# EasyEDA schematic SCH_Esp32-Dev-board_2026-06-18.json
TITLE: Sheet_1; REV: 1.0; Date: 2026-06-16; Sheet: 1/1; Drawn By: vivaanchauhan4569; Company: Your Company
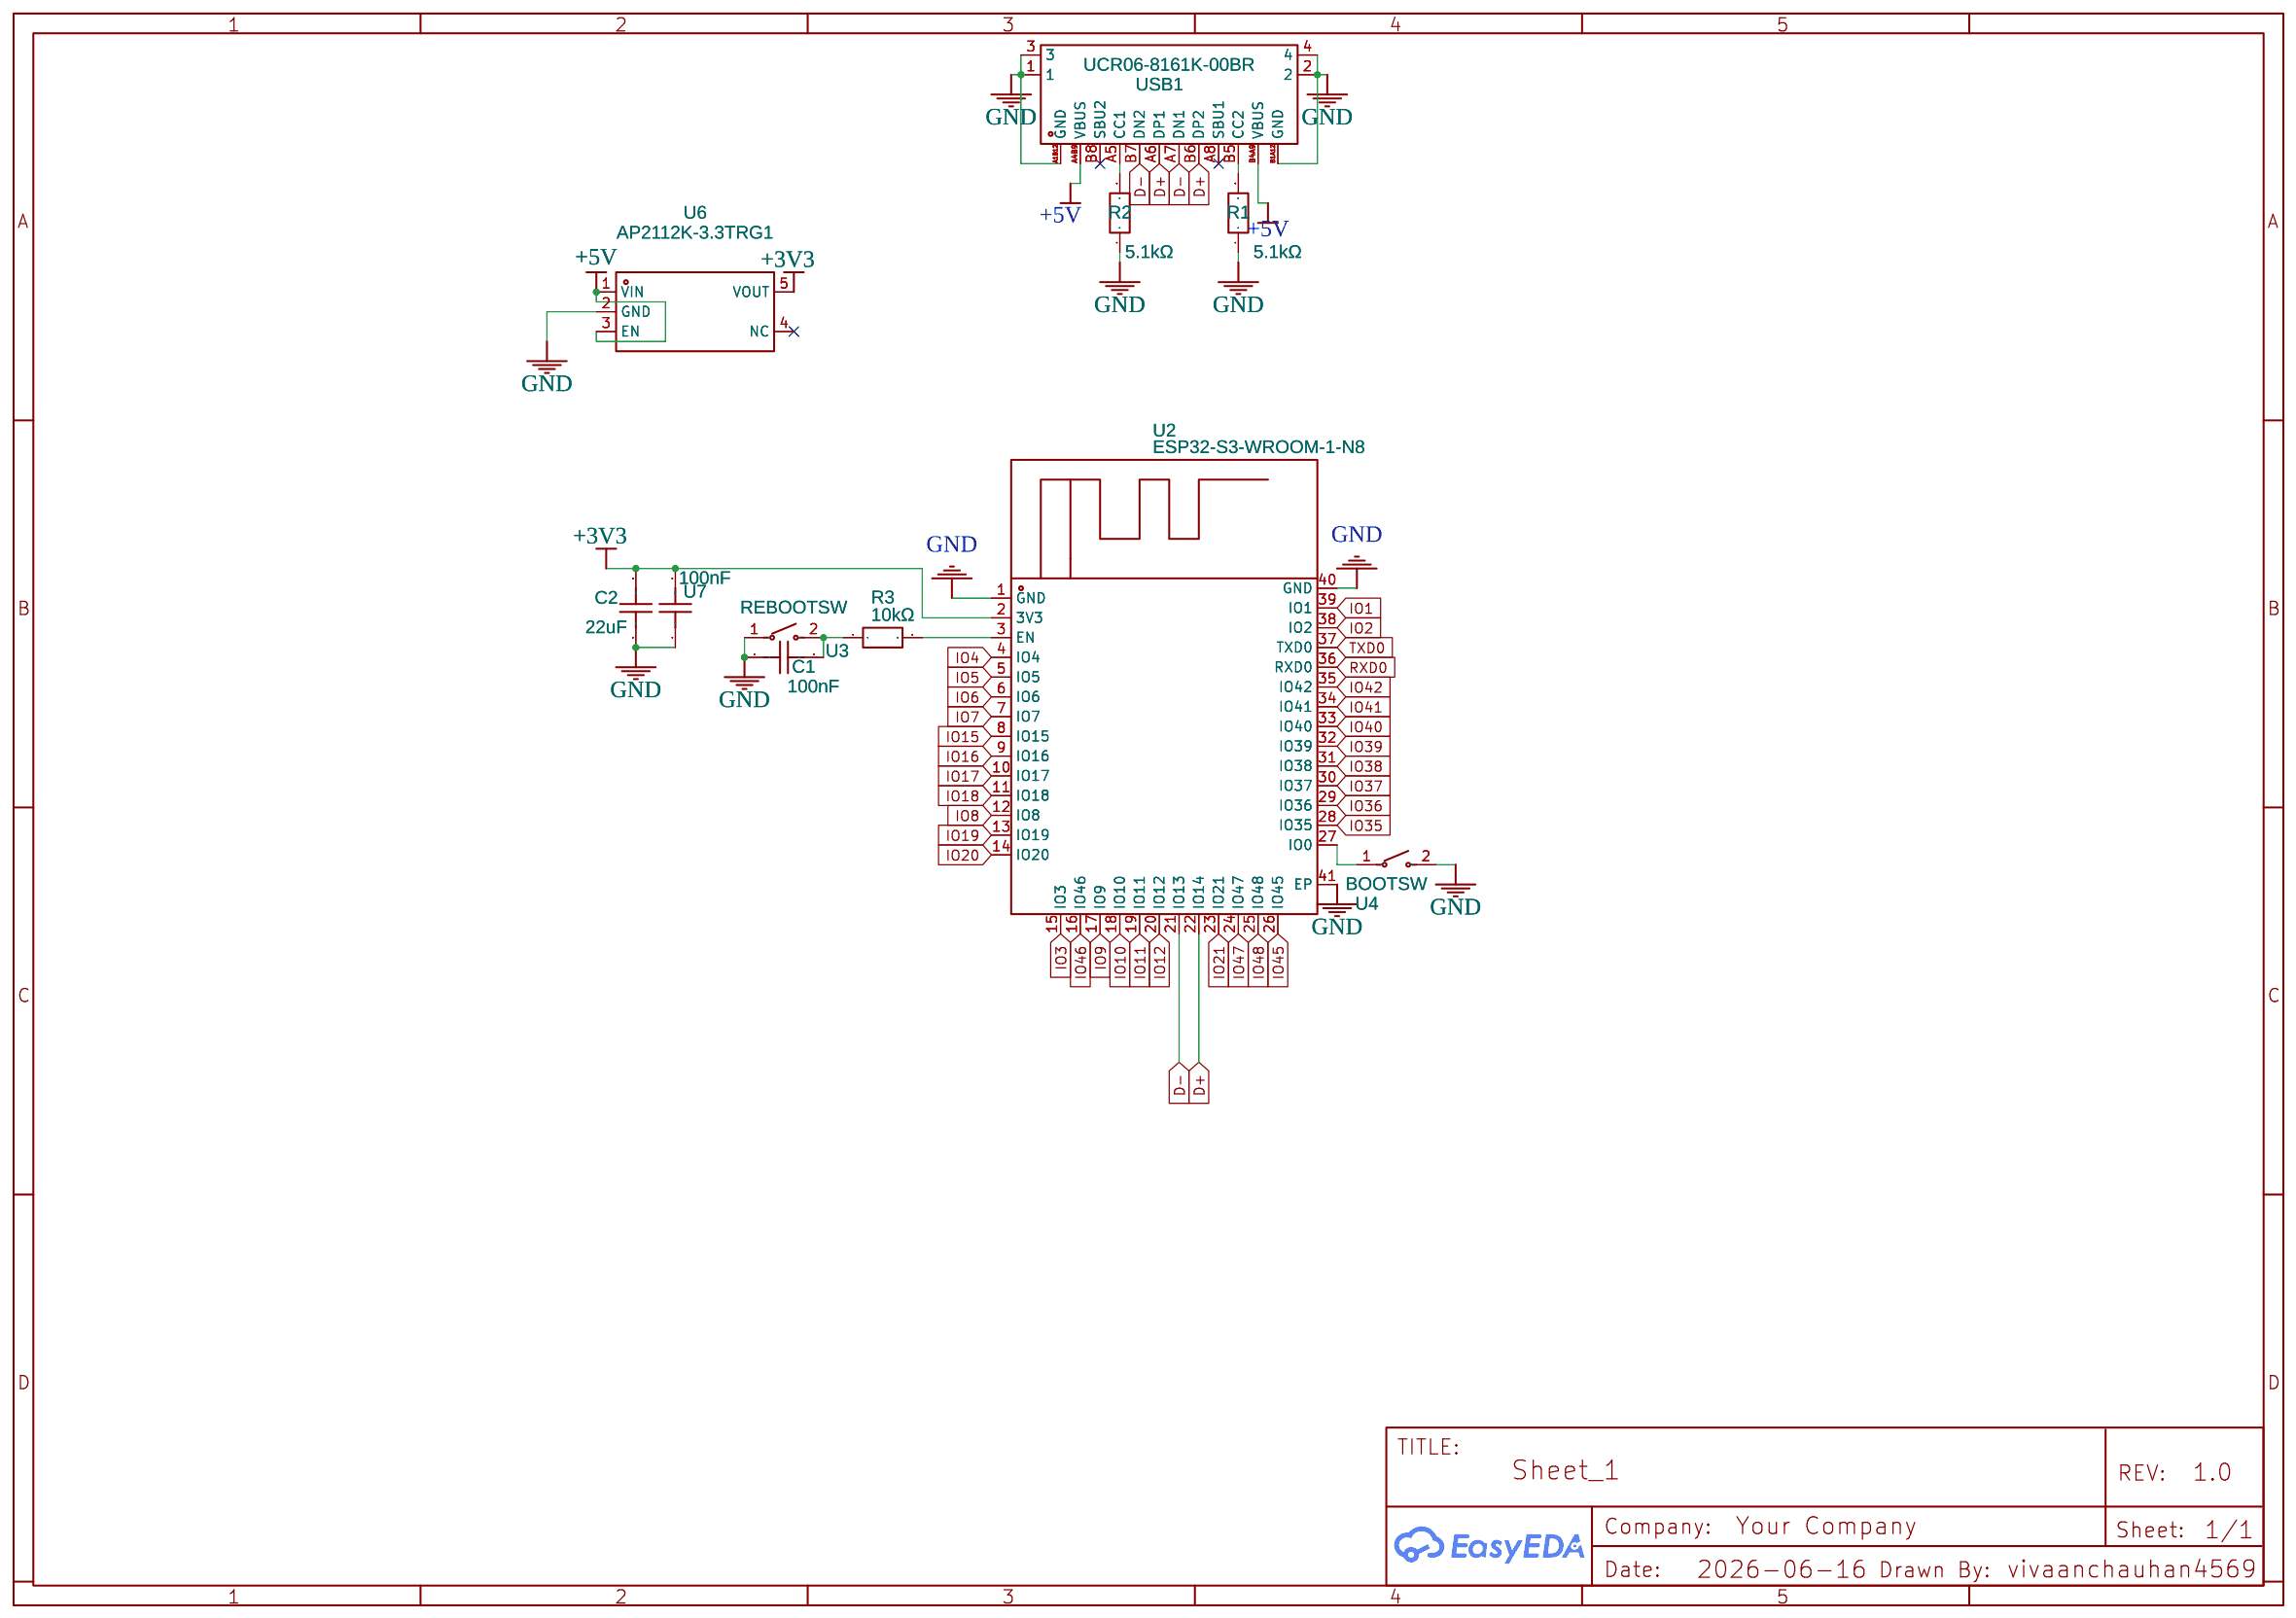
[diagram p0: schematic sheet]

## Parts
C1  100nF  [C0201]
C2  22uF  [C0603]
R1  5.1kΩ  [R0402]
R2  5.1kΩ  [R0402]
R3  10kΩ  [R0603]
U2  ESP32-S3-WROOM-1-N8  [WIFIM-SMD_ESP32-S3-WROOM-1-N8]
U3  REBOOTSW  [SW-SMD_L3.9-W3.0-P4.45]
U4  BOOTSW  [SW-SMD_L3.9-W3.0-P4.45]
U6  AP2112K-3.3TRG1  [SOT-25-5_L2.9-W1.6-P0.95-LS2.8-BL]
U7  100nF  [C0603]
USB1  UCR06-8161K-00BR  [TYPE-C-SMD_TYPE-C-16P-3MD-040]

## Library data of the parts
C1 = C0201X7R100-104KNP: Supplier: LCSC; Supplier Part: C3871673; Manufacturer: Venkel; JLCPCB Part Class: Extended Part; Contributor: lcsc
C2 = CGA0603X5R226M6R3JT: Supplier: LCSC; Supplier Part: C6119880; Manufacturer: HRE(芯声); Contributor: lcsc; JLCPCB Part Class: Extended Part
R1 R2 = HQ02WAF5101TCE: Supplier: LCSC; Supplier Part: C2791532; Manufacturer: UNI-ROYAL(厚声); JLCPCB Part Class: Extended Part; Contributor: lcsc
R3 = CPF0603B10KE1: Supplier: LCSC; Supplier Part: C4109781; Manufacturer: TE Connectivity(泰科电子); JLCPCB Part Class: Extended Part; Contributor: lcsc
U2 = ESP32-S3-WROOM-1-N8: Contributor: lcsc; Supplier: LCSC; Supplier Part: C2913198; Manufacturer: ESPRESSIF(乐鑫); JLCPCB Part Class: Extended Part
U3 U4 = SW-PB_C9900011101: Contributor: LCSC; Supplier: LCSC; Supplier Part: C9900011101; Manufacturer: null; Manufacturer Part: SW-PB; JLCPCB Part Class: Extended Part
U6 = AP2112K-3.3TRG1: Contributor: LCSC; Supplier: LCSC; Manufacturer: DIODES(美台); Supplier Part: C51118; JLCPCB Part Class: Extended Part
U7 = AM03B104K500AT: Supplier: LCSC; Supplier Part: C20624283; Manufacturer: FH(风华); Contributor: lcsc; JLCPCB Part Class: Extended Part
USB1 = UCR06-8161K-00BR: Supplier: LCSC; Supplier Part: C9900214533; Manufacturer: null; JLCPCB Part Class: Extended Part; Contributor: lcsc

## Nets
+3V3: C2.2 U2.2(3V3) U6.5(VOUT) U7.2
+5V: U6.1(VIN) U6.3(EN) USB1.A4B9(VBUS) USB1.B4A9(VBUS)
GND: C1.1 C2.1 R1.1 R2.1 U2.1(GND) U2.40(GND) U2.41(EP) U3.1 U4.2 U6.2(GND) U7.1 USB1.1 USB1.2 USB1.3 USB1.4 USB1.A1B12(GND) USB1.B1A12(GND)
D+: U2.22(IO14) USB1.A6(DP1) USB1.B6(DP2)
D-: U2.21(IO13) USB1.A7(DN1) USB1.B7(DN2)
IO1: U2.39(IO1)
IO2: U2.38(IO2)
IO3: U2.15(IO3)
IO4: U2.4(IO4)
IO5: U2.5(IO5)
IO6: U2.6(IO6)
IO7: U2.7(IO7)
IO8: U2.12(IO8)
IO9: U2.17(IO9)
IO10: U2.18(IO10)
IO11: U2.19(IO11)
IO12: U2.20(IO12)
IO15: U2.8(IO15)
IO16: U2.9(IO16)
IO17: U2.10(IO17)
IO18: U2.11(IO18)
IO19: U2.13(IO19)
IO20: U2.14(IO20)
IO21: U2.23(IO21)
IO35: U2.28(IO35)
IO36: U2.29(IO36)
IO37: U2.30(IO37)
IO38: U2.31(IO38)
IO39: U2.32(IO39)
IO40: U2.33(IO40)
IO41: U2.34(IO41)
IO42: U2.35(IO42)
IO45: U2.26(IO45)
IO46: U2.16(IO46)
IO47: U2.24(IO47)
IO48: U2.25(IO48)
RXD0: U2.36(RXD0)
TXD0: U2.37(TXD0)
Net-(C1-2): C1.2 R3.1 U3.2
Net-(R1-2): R1.2 USB1.B5(CC2)
Net-(R2-2): R2.2 USB1.A5(CC1)
Net-(R3-2): R3.2 U2.3(EN)
Net-(U2-27): U2.27(IO0) U4.1

Not connected (* = marked no-connect by the designer): U6 4(NC)*; USB1 A8(SBU1)* B8(SBU2)*
